# EAGLE design tweeq-eMod_VibMotor (EAGLE 7.2.0)
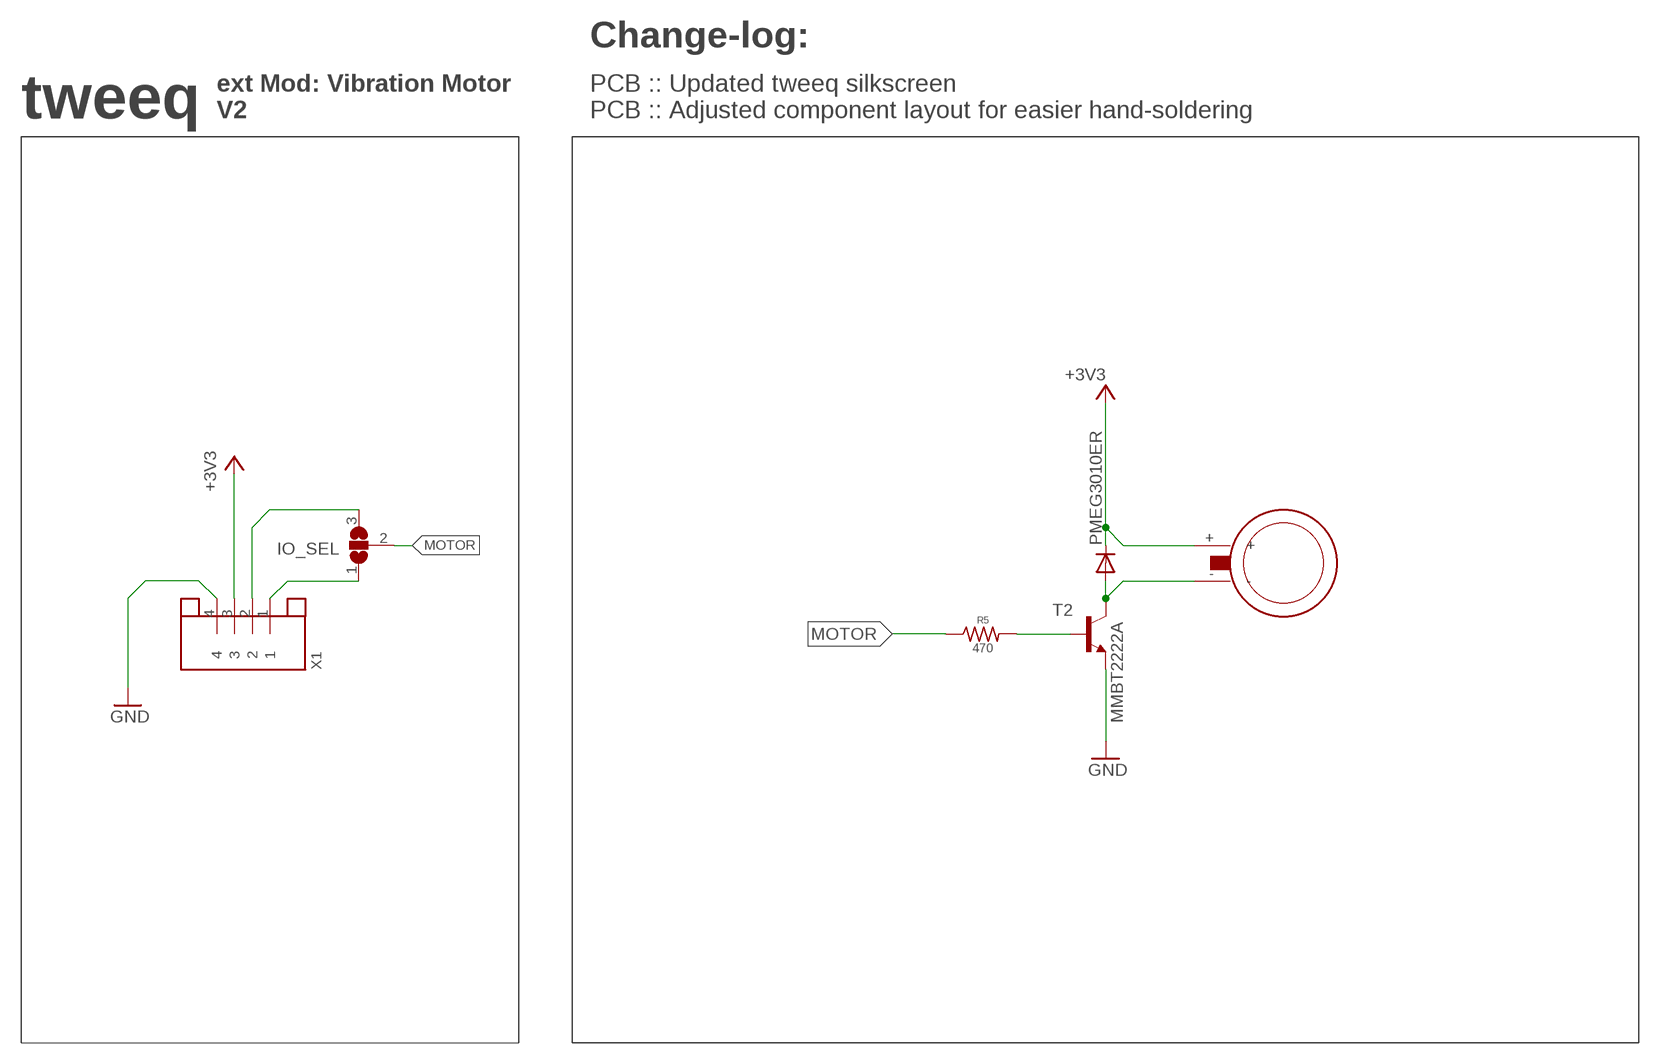
[diagram p0: schematic, sheet 1]

## Parts
IO_SEL  JUMPER_SJ2WS  [JUMPER_SJ_S]
PMEG3010ER  PMEG3010ER/MOD  [SOD123-MOD]
R5  470  R-US_R0603  [R0603]
T2  2N3904MMBT3904  [SOT23-3]
U$2  VMOTOR_10  [VMOTOR_10]
X1  JST-4PINSH  [SH1.0-4PIN]

## Nets
+3V3: PMEG3010ER.C U$2.+ X1.3
GND: T2.2(E) X1.4
MOTOR: IO_SEL.2 R5.1
N$1: R5.2 T2.1(B)
N$2: PMEG3010ER.A T2.3(C) U$2.-
N$3: IO_SEL.3 X1.2
N$4: IO_SEL.1 X1.1

## Notes on the sheet
- Change-log:
- tweeq
- ext Mod: Vibration Motor
  V2
- PCB :: Updated tweeq silkscreen
  PCB :: Adjusted component layout for easier hand-soldering
- MMBT2222A

## Library data of the parts
IO_SEL = AISCube:JUMPER_SJ2W: SMD solder JUMPER
PMEG3010ER = AISCube:PMEG3010ER: Schottky Barrier Rectiﬁer PMEG3010ER 1 A low VF MEGA Schottky barrier rectiﬁer
R5 = rcl:R-US_: RESISTOR, American symbol
T2 = AISCube:2N3904: NPN TRANSISTOR
U$2 = AISCube:VMOTOR: Vibration Motor
X1 = AISCube:JST-4PIN: JST 4 Pin

## Board
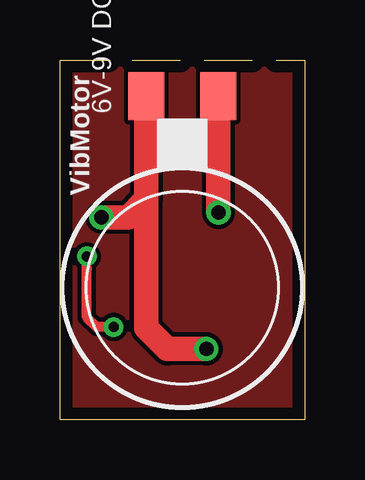
[diagram p1: board, top side]
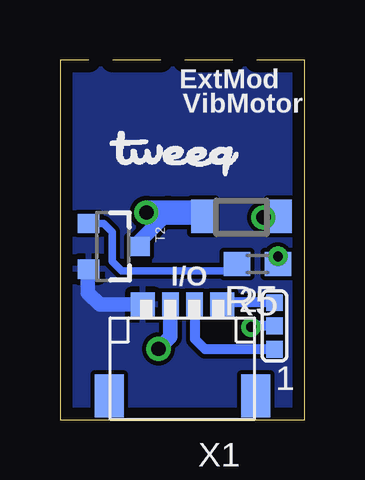
[diagram p2: board, bottom side, seen from below]

Size 10.2 x 15 mm. Coordinates in mm from the lower left corner, seen from the top.
Outline: 0,15 10.2,15 10.2,0 0,0 0,15
Copper layers (1*16): Top 0.0356mm / dielectric 1.5011mm / Bottom 0.0356mm
Design rules "AISCube": minimum track width 7mil, minimum drill 14mil, track to track 7mil, track to pad 7mil, pad to pad 7mil, via to via 7mil, smd to smd 0mil, copper to edge 20mil, drill to drill 8mil, minimum pad ring 10mil, minimum via ring 8mil, stop-mask expansion 4mil, vias tented up to drill 32mil, thermal gap 10mil

### Footprints (pad centres in the part's own frame; a part is rotated, then mirrored left to right if it is on the bottom)
JUMPER_SJ_S = smd 0.7 x 0.7: 1 -0.974,-0.02; 2 0,-0.02; 3 0.974,-0.02
SOD123-MOD = smd 1 x 1.4: A 1.5,-0.035; C -1.7,-0.035
R0603 = smd 1.1 x 1: 1 -0.85,0; 2 0.85,0
SOT23-3 = smd 0.8 x 0.9: 1 -0.95,-1; 2 0.95,-1; 3 0,1.1
VMOTOR_10 = smd 1.5 x 2: + 1.5,-8; - -1.5,-8
SH1.0-4PIN = smd 1 x 1: 1 -1.65,-0.55; 4 1.65,-0.55 | smd 0.7 x 1: 2 -0.5,-0.55; 3 0.5,-0.55 | smd 1.2 x 1.8: P$1 -3.05,3.25; P$2 3.05,3.25

### Placement (x,y rotation side)
IO_SEL  1.24,3.9 270 bottom
PMEG3010ER  2.74,8.44 180 bottom
R5  1.97,6.5 180 bottom
T2  8,7.22 270 bottom
U$1  [TWEEQ-LOGO-S]  8.13,10.16 0 bottom
U$2  5.1,5.5 180 top
X1  5.1,4.24 180 bottom

### Tracks (layer width: path | path; a pad name or v marks a point on that pad's centre or on a via)
+3V3  (via drill 0.6)
  Top 1.016: U$2.+ 3.6,10.36 3.6,9.19 | 3.6,9.19 2.85,8.43 v1.73,8.43 | v6.1,2.95 4.47,2.95 3.66,3.76 3.6,3.82 3.6,9.19
  Bottom 0.61: X1.3 5.6,3.44 v6.1,2.95
  Bottom 1.016: v1.73,8.43 1.08,8.43 PMEG3010ER.C
GND
  Bottom 0.61: X1.4 8.55,4.79 9.04,5.28 9.04,6.24 T2.2
  pour Top: 10.1,14.8 10.1,0.18 0.15,0.18 0.15,14.8
  pour Bottom: 10.1,0.18 10.1,14.8 0.15,14.8 0.15,0.18
MOTOR  (via drill 0.41)
  Top 0.406: v2.23,3.86 1.52,3.86 1.12,4.27 1.12,6.29 v1.12,6.8 v1.12,6.81
  Bottom 0.406: IO_SEL.2 2.19,3.9 v2.23,3.86 | v1.12,6.81 1.12,6.3 R5.1
N$1
  Bottom 0.305: R5.2 2.85,6.5 3.15,6.2 7.62,6.2 8.03,6.6 8.03,7.82 8.38,8.17 T2.1
N$2  (via drill 0.6)
  Top 1.016: U$2.- v6.6,8.64
  Bottom 0.61: T2.3 6.91,7.42 5.69,8.64
  Bottom 1.016: v6.6,8.64 5.69,8.64 4.4,8.64 PMEG3010ER.A
N$3
  Bottom 0.406: IO_SEL.3 4.15,2.93 4.57,3.35 4.57,4.76 X1.2
N$4
  Bottom 0.406: IO_SEL.1 3.37,4.88 X1.1

### Text on the board
tPlace: VibMotor
bPlace: ExtMod | VibMotor | I/O | 2 | 1
tNames: 6V-9V DC | ON
bNames: Breadboard | V-Reg | Module